# EAGLE design board_autorouted_2_layers (EAGLE 6.6.0)
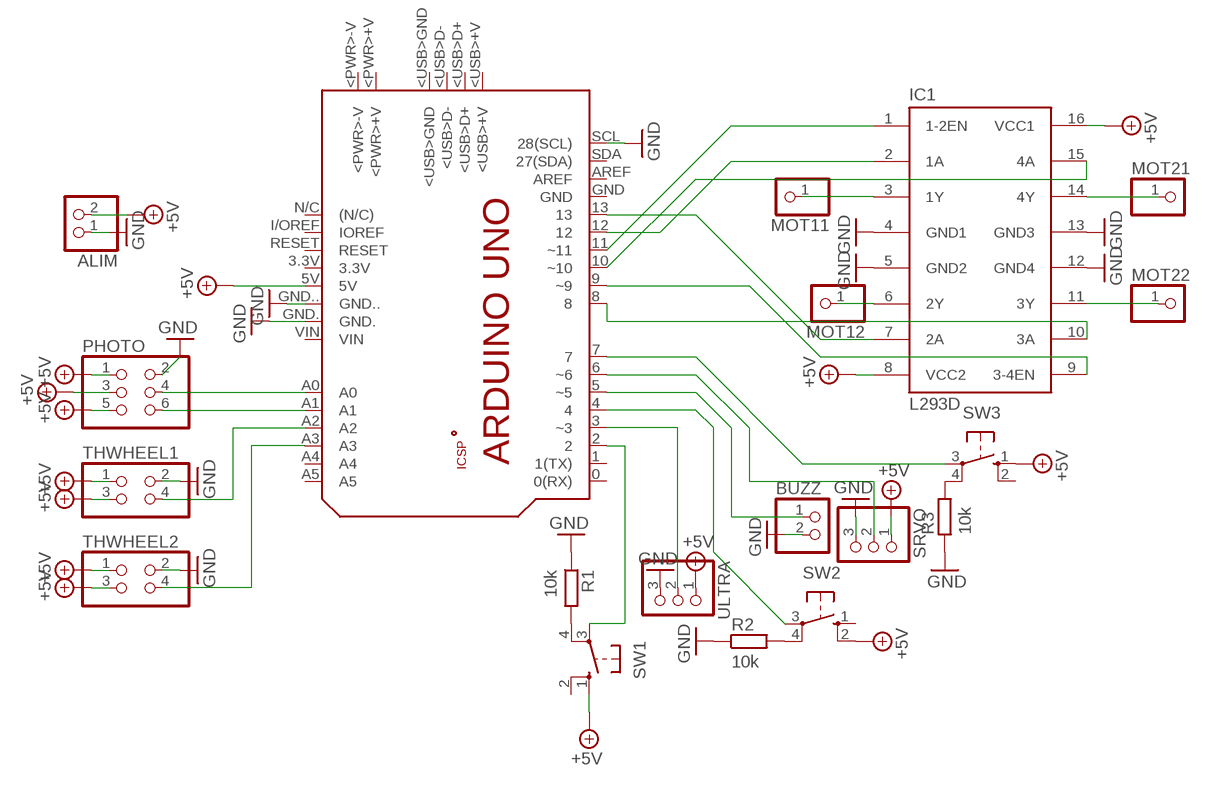
[diagram p0: schematic, sheet 1]

## Parts
ALIM  PINHD-1X2  [1X02]
BUZZ  PINHD-1X2  [1X02]
IC1  L293D  [DIL16]
MOT11  PINHD-1X1  [1X01]
MOT12  PINHD-1X1  [1X01]
MOT21  PINHD-1X1  [1X01]
MOT22  PINHD-1X1  [1X01]
PCB1  ARDUINO_UNO  [ARDUINO_UNO]
PHOTO  PINHD-2X3  [2X03]
R1  10k  RESISTOR  [R0603]
R2  10k  RESISTOR  [R0603]
R3  10k  RESISTOR  [R0603]
SRVO  PINHD-1X3  [1X03]
SW1  40-XX  [B3F-40XX]
SW2  40-XX  [B3F-40XX]
SW3  40-XX  [B3F-40XX]
THWHEEL1  PINHD-2X2  [2X02]
THWHEEL2  PINHD-2X2  [2X02]
ULTRA  PINHD-1X3  [1X03]

## Nets
+5V: ALIM.2 IC1.8(VCC2) IC1.16(VCC1) PCB1.5V PHOTO.1 PHOTO.3 PHOTO.5 SRVO.1 SW1.1(S) SW2.2(S1) SW3.1(S) THWHEEL1.1 THWHEEL1.3 THWHEEL2.1 THWHEEL2.3 ULTRA.1
GND: ALIM.1 BUZZ.2 IC1.4(GND1) IC1.5(GND2) IC1.12(GND4) IC1.13(GND3) PCB1.GND. PCB1.GND.. PCB1.SCL(28(SCL)) R1.1 R2.1 R3.1 SRVO.3 THWHEEL1.2 THWHEEL2.2 ULTRA.3
N$1: IC1.3(1Y) MOT11.1
N$2: IC1.6(2Y) MOT12.1
N$3: IC1.14(4Y) MOT21.1
N$4: IC1.11(3Y) MOT22.1
N$5: IC1.2(1A) PCB1.12
N$6: IC1.7(2A) PCB1.13
N$7: IC1.15(4A) PCB1.10(~10)
N$8: IC1.9(3-4EN) PCB1.9(~9)
N$9: IC1.10(3A) PCB1.8
N$10: IC1.1(1-2EN) PCB1.11(~11)
N$11: PCB1.A1 PHOTO.6
N$12: PCB1.A0 PHOTO.4
N$13: PHOTO.2 ; supply symbol labelled GND
N$14: PCB1.6(~6) SRVO.2
N$15: PCB1.3(~3) ULTRA.2
N$16: BUZZ.1 PCB1.5(~5)
N$17: PCB1.7 SW3.3(P)
N$18: R3.2 SW3.4(P1)
N$19: PCB1.4 SW2.3(P)
N$20: R2.2 SW2.4(P1)
N$21: R1.2 SW1.4(P1)
N$22: PCB1.A2 THWHEEL1.4
N$23: PCB1.A3 THWHEEL2.4
N$24: PCB1.2 SW1.3(P)
Unconnected: PCB1.0(0(RX)) PCB1.1(1(TX)) PCB1.3.3V PCB1.+5V PCB1.<PWR>+V PCB1.<PWR>-V PCB1.<USB>+V PCB1.<USB>D+ PCB1.<USB>D- PCB1.<USB>GND PCB1.A4 PCB1.A5 PCB1.AREF PCB1.GND PCB1.GND_ PCB1.I/OREF(IOREF) PCB1.MISO PCB1.MOSI PCB1.N/C((N/C)) PCB1.RESET PCB1.RESET. PCB1.SCK PCB1.SDA(27(SDA)) PCB1.VIN SW1.2(S1) SW2.1(S) SW3.2(S1)

## Library data of the parts
ALIM BUZZ = pinhead:PINHD-1X2: PIN HEADER
IC1 = st-microelectronics:L293D: PUSH-PULL 4 CHANNEL DRIVER; MPN: L293D; OC_FARNELL: 9589619; OC_NEWARK: 56P8249
MOT11 MOT12 MOT21 MOT22 = pinhead:PINHD-1X1: PIN HEADER
PCB1 = E14_Arduino_revB:ARDUINO_UNO: Device for representing an Arduino Uno board with a footprint in an EAGLE design. Created by Dave Young for Element14. More EAGLE documentation at: http://www.element14.com/community/community/knode/cadsoft_eagle
PHOTO = pinhead:PINHD-2X3: PIN HEADER
R1-R3 = BaseApp:RESISTOR: Resistance Package :- 0603 Mount :-Surface mount
SRVO ULTRA = pinhead:PINHD-1X3: PIN HEADER
SW1-SW3 = adafruit:40-XX: OMRON SWITCH; MF: OMRON COMPONENTS USA; MPN: B3F-4000; OC_FARNELL: 176434; OC_NEWARK: 36K3105
THWHEEL1 THWHEEL2 = pinhead:PINHD-2X2: PIN HEADER

## Board
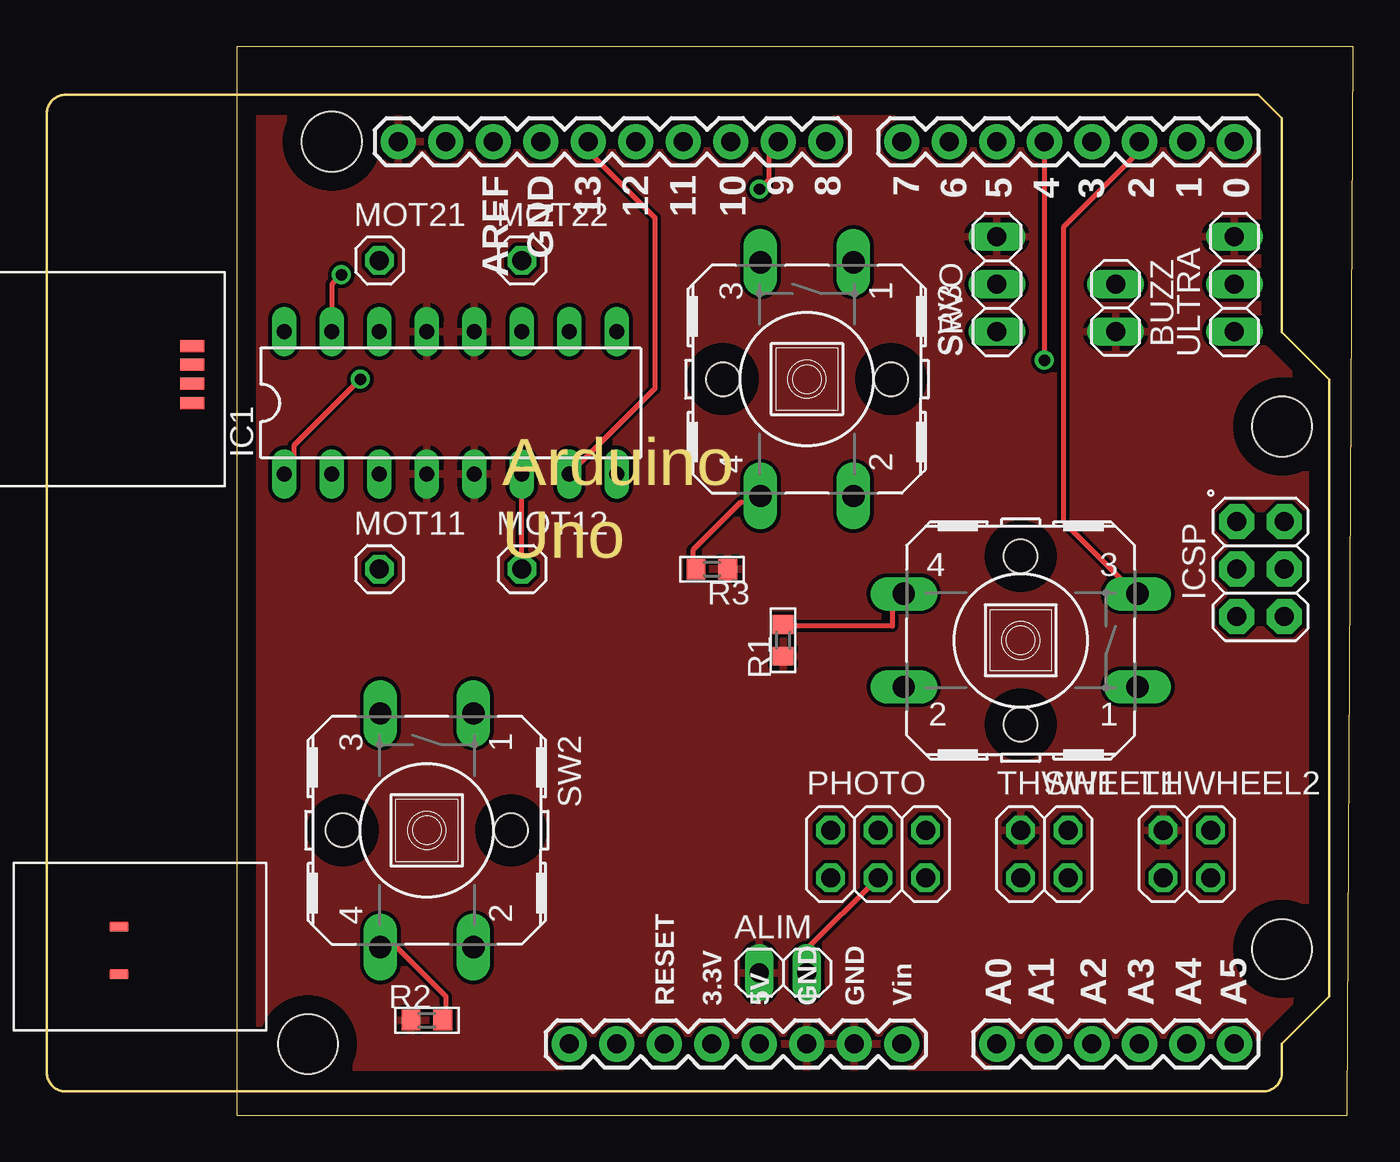
[diagram p1: board, top side]
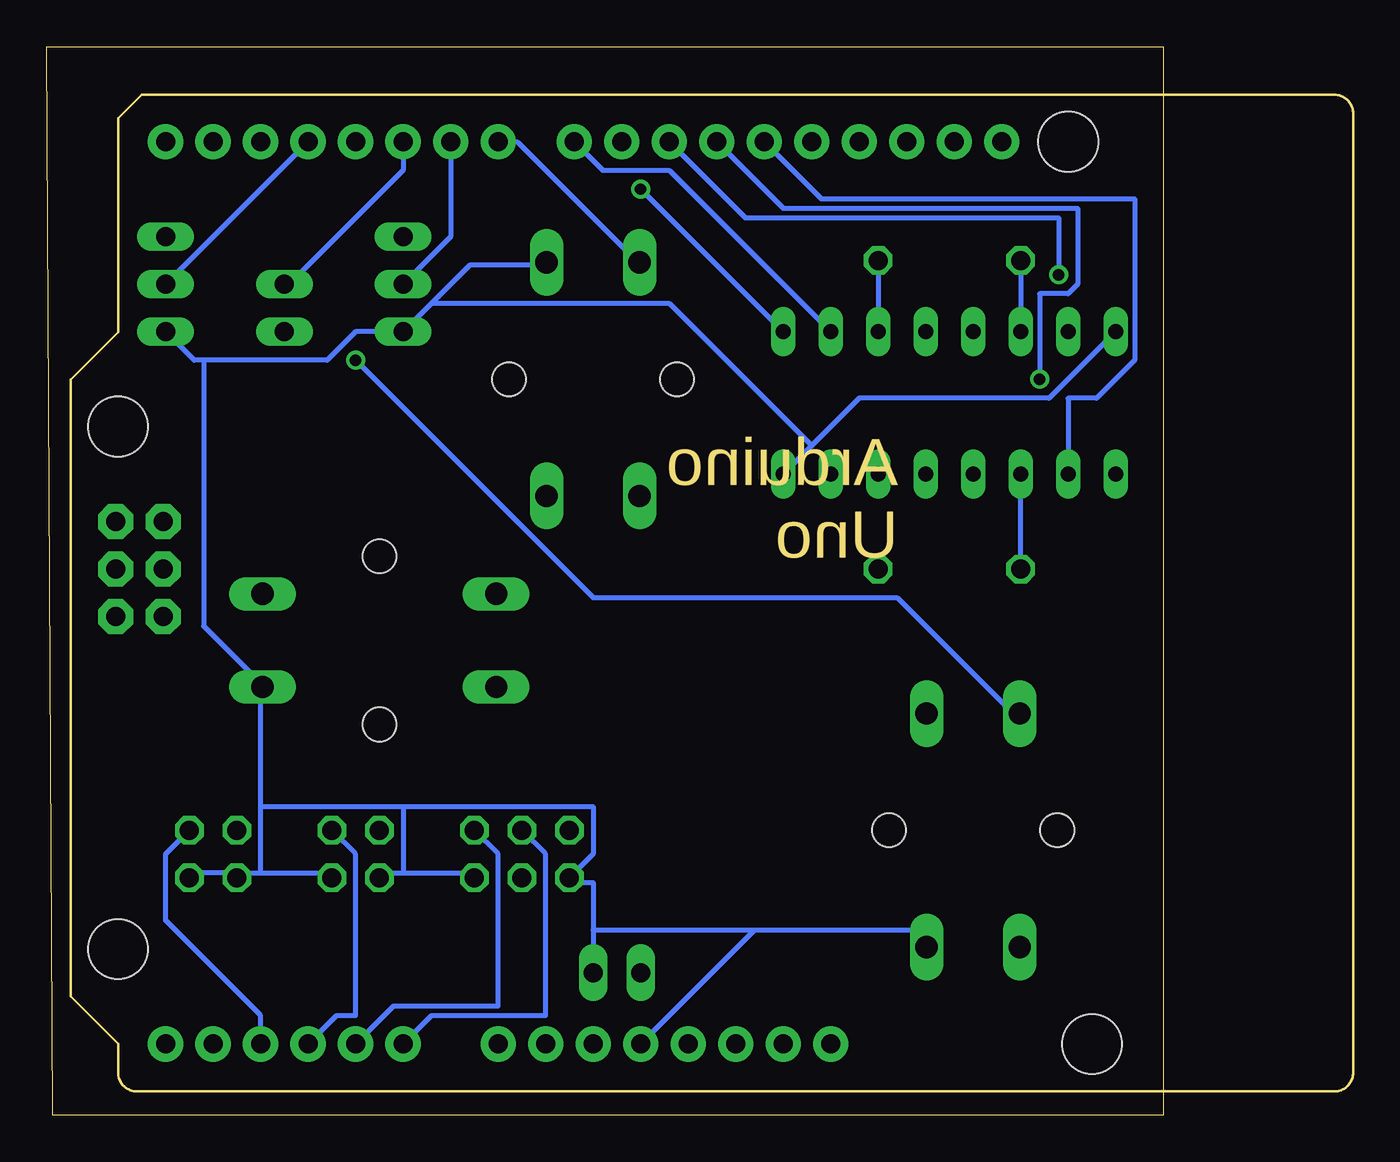
[diagram p2: board, bottom side, seen from below]

Size 59.69 x 57.15 mm. Coordinates in mm from the lower left corner, seen from the top.
Outline: 0,0 59.36,0 59.69,57.15 0,57.14 0,0
Copper layers (1*16): Top 0.035mm / dielectric 1.5mm / Bottom 0.035mm
Design rules "default": minimum track width 10mil, minimum drill 24mil, track to track 8mil, track to pad 8mil, pad to pad 8mil, via to via 8mil, smd to smd 8mil, copper to edge 40mil, drill to drill 8mil, minimum pad ring 10mil, minimum via ring 8mil, stop-mask expansion 4mil, vias tented up to drill 0mil, thermal gap 10mil

### Footprints (pad centres in the part's own frame; a part is rotated, then mirrored left to right if it is on the bottom)
1X02 = drill 1.016 long: 1 -1.27,0; 2 1.27,0
DIL16 = drill 0.813 long: 1 -8.89,-3.81; 2 -6.35,-3.81; 3 -3.81,-3.81; 4 -1.27,-3.81; 5 1.27,-3.81; 6 3.81,-3.81; 7 6.35,-3.81; 8 8.89,-3.81; 9 8.89,3.81; 10 6.35,3.81; 11 3.81,3.81; 12 1.27,3.81; 13 -1.27,3.81; 14 -3.81,3.81; 15 -6.35,3.81; 16 -8.89,3.81
1X01 = drill 1.016 octagon: 1 0,0
ARDUINO_UNO = drill 1.016 pad 1.88: 0 63.5,50.8; 1 60.96,50.8; 2 58.42,50.8; 3 55.88,50.8; 3.3V 35.56,2.54; 4 53.34,50.8; 5 50.8,50.8; 5V 38.1,2.54; 6 48.26,50.8; 7 45.72,50.8; 8 41.656,50.8; 9 39.116,50.8; 10 36.576,50.8; 11 34.036,50.8; 12 31.496,50.8; 13 28.956,50.8; A0 50.8,2.54; A1 53.34,2.54; A2 55.88,2.54; A3 58.42,2.54; A4 60.96,2.54; A5 63.5,2.54; AREF 23.876,50.8; GND 26.416,50.8; GND. 43.18,2.54; GND.. 40.64,2.54; I/OREF 30.48,2.54; N/C 27.94,2.54; RESET 33.02,2.54; SCL 18.796,50.8; SDA 21.336,50.8; VIN 45.72,2.54 | drill 1.016 pad 1.88 octagon: +5V 66.167,30.48; GND_ 66.167,25.4; MISO 63.627,30.48; MOSI 66.167,27.94; RESET. 63.627,25.4; SCK 63.627,27.94 | smd 1.016 x 0.508: <PWR>+V 3.861,8.814; <PWR>-V 3.861,6.274 | smd 1.27 x 0.635: <USB>+V 7.772,39.878; <USB>D+ 7.772,38.887; <USB>D- 7.772,37.871; <USB>GND 7.772,36.83 | hole 3.2: 66.04,7.62; 66.04,35.56; 15.24,50.8; 13.97,2.54
2X03 = drill 1.016 octagon: 1 -2.54,-1.27; 2 -2.54,1.27; 3 0,-1.27; 4 0,1.27; 5 2.54,-1.27; 6 2.54,1.27
R0603 = smd 1 x 1.1: 1 -0.85,0; 2 0.85,0
1X03 = drill 1.016 long: 1 -2.54,0; 2 0,0; 3 2.54,0
B3F-40XX = drill 1.194 long: 1 -6.248,2.489; 2 6.248,2.489; 3 -6.248,-2.489; 4 6.248,-2.489 | hole 1.803: 0,-4.496; 0,4.496
2X02 = drill 1.016 octagon: 1 -1.27,-1.27; 2 -1.27,1.27; 3 1.27,-1.27; 4 1.27,1.27

### Placement (x,y rotation side)
ALIM  29.21,7.62 0 top
BUZZ  46.99,43.18 270 top
IC1  11.43,38.1 0 top
MOT11  7.62,29.21 0 top
MOT12  15.24,29.21 0 top
MOT21  7.62,45.72 0 top
MOT22  15.24,45.72 0 top
PCB1  -10.16,1.27 0 top
PHOTO  34.29,13.97 0 top
R1  29.21,25.4 90 top
R2  10.16,5.08 0 top
R3  25.4,29.21 180 top
SRVO  40.64,44.45 90 top
SW1  41.91,25.4 180 top
SW2  10.16,15.24 270 top
SW3  30.48,39.37 270 top
THWHEEL1  43.18,13.97 0 top
THWHEEL2  50.8,13.97 0 top
ULTRA  53.34,44.45 90 top

### Tracks (layer width: path | path; a pad name or v marks a point on that pad's centre or on a via)
+5V
  Top 0.254: PHOTO.3 30.48,8.89 ALIM.2
  Bottom 0.254: 30.48,9.91 30.48,12.45 31.5,12.45 PHOTO.1 30.48,13.97 30.48,16.51 40.64,16.51 | 30.48,9.91 ALIM.2 | 30.48,9.91 21.84,9.91 | 21.84,9.91 13.21,9.91 12.7,9.4 SW2.2 | 21.84,9.91 PCB1.5V | 40.64,12.95 41.66,12.95 THWHEEL1.1 | 40.64,12.95 37.08,12.95 PHOTO.5 | 48.26,12.95 49.28,12.95 THWHEEL2.1 49.78,12.95 51.82,12.95 THWHEEL2.3 | 48.26,12.95 44.7,12.95 THWHEEL1.3 | 48.26,12.95 48.26,16.51 | 48.26,16.51 48.26,22.61 SW1.1 48.26,23.11 51.31,26.16 51.31,40.39 | 40.64,16.51 40.64,12.95 | 48.26,16.51 40.64,16.51 | 18.8,35.81 16.26,38.35 6.1,38.35 IC1.16 | 18.8,35.81 IC1.8 | 39.12,43.43 37.08,45.47 33.02,45.47 SW3.1 | 39.12,43.43 SRVO.1 43.18,41.91 44.7,40.39 51.31,40.39 | ULTRA.1 51.82,40.39 51.31,40.39 | 18.8,35.81 26.42,43.43 39.12,43.43
GND
  pour Top: -1.27,58.42 -1.27,-1.27 60.96,-1.27 60.96,58.42
N$1
  Bottom 0.254: MOT11.1 IC1.3
N$2
  Top 0.254: MOT12.1 IC1.6
N$3
  Bottom 0.254: MOT21.1 IC1.14
N$4
  Bottom 0.254: MOT22.1 IC1.11
N$5
  Bottom 0.254: IC1.2 5.08,38.35 3.56,38.35 1.52,40.39 1.52,49.02 18.29,49.02 PCB1.12
N$6
  Top 0.254: IC1.7 22.35,38.86 22.35,48.01 18.8,51.56 PCB1.13
N$7  (via drill 0.61)
  Top 0.254: IC1.15 5.08,44.45 v5.59,44.96
  Bottom 0.254: v5.59,44.96 5.59,48.01 22.35,48.01 PCB1.10
N$8  (via drill 0.61)
  Top 0.254: v27.94,49.53 28.45,50.04 28.45,51.56 PCB1.9
  Bottom 0.254: v27.94,49.53 IC1.9
N$9
  Bottom 0.254: IC1.10 26.42,50.55 29.97,50.55 PCB1.8
N$10  (via drill 0.61)
  Top 0.254: IC1.1 3.05,34.8 3.05,35.81 v6.6,39.37
  Bottom 0.254: v6.6,39.37 6.6,43.94 5.08,43.94 4.57,44.45 4.57,48.51 20.32,48.51 PCB1.11
N$11
  Bottom 0.254: PHOTO.6 35.56,13.97 35.56,5.84 41.15,5.84 PCB1.A1
N$12
  Bottom 0.254: PHOTO.4 33.02,13.97 33.02,5.33 39.12,5.33 PCB1.A0
N$14
  Bottom 0.254: SRVO.2 38.1,46.99 PCB1.6
N$15
  Bottom 0.254: PCB1.3 ULTRA.2
N$16
  Bottom 0.254: PCB1.5 40.64,50.55 46.74,44.45 BUZZ.1
N$17
  Bottom 0.254: PCB1.7 34.54,52.07 28.45,45.97 SW3.3
N$18
  Top 0.254: R3.2 24.38,29.21 24.38,30.23 26.92,32.77 27.94,32.77 SW3.4
N$19  (via drill 0.61)
  Top 0.254: PCB1.4 v43.18,40.39
  Bottom 0.254: v43.18,40.39 30.48,27.69 14.22,27.69 8.13,21.59 SW2.3
N$20
  Top 0.254: R2.2 11.18,5.33 11.18,6.35 8.13,9.4 SW2.4
N$21
  Top 0.254: R1.2 29.46,26.16 35.05,26.16 35.05,27.18 35.56,27.69 SW1.4
N$22
  Bottom 0.254: THWHEEL1.4 43.18,13.97 43.18,5.33 44.2,5.33 PCB1.A2
N$23
  Bottom 0.254: THWHEEL2.4 53.34,13.97 53.34,10.41 48.26,5.33 PCB1.A3
N$24
  Top 0.254: PCB1.2 48.26,51.56 44.2,47.5 44.2,31.75 47.75,28.19 SW1.3